# EasyEDA Pro project MSDR_EzEdaPro.eprj, schematic Schematic2
Create Date: 2024-09-18; Page Name: P1; Project Name: MSDR_EzEdaPro; Schematic Name: Schematic2; Update Date: 2024-09-18; Company: EasyEDA.com; Drawn: EasyEDA; Page Size: A4; Part Number: JLCPCB-002; Reviewed: EasyEDA; Version: V0.1
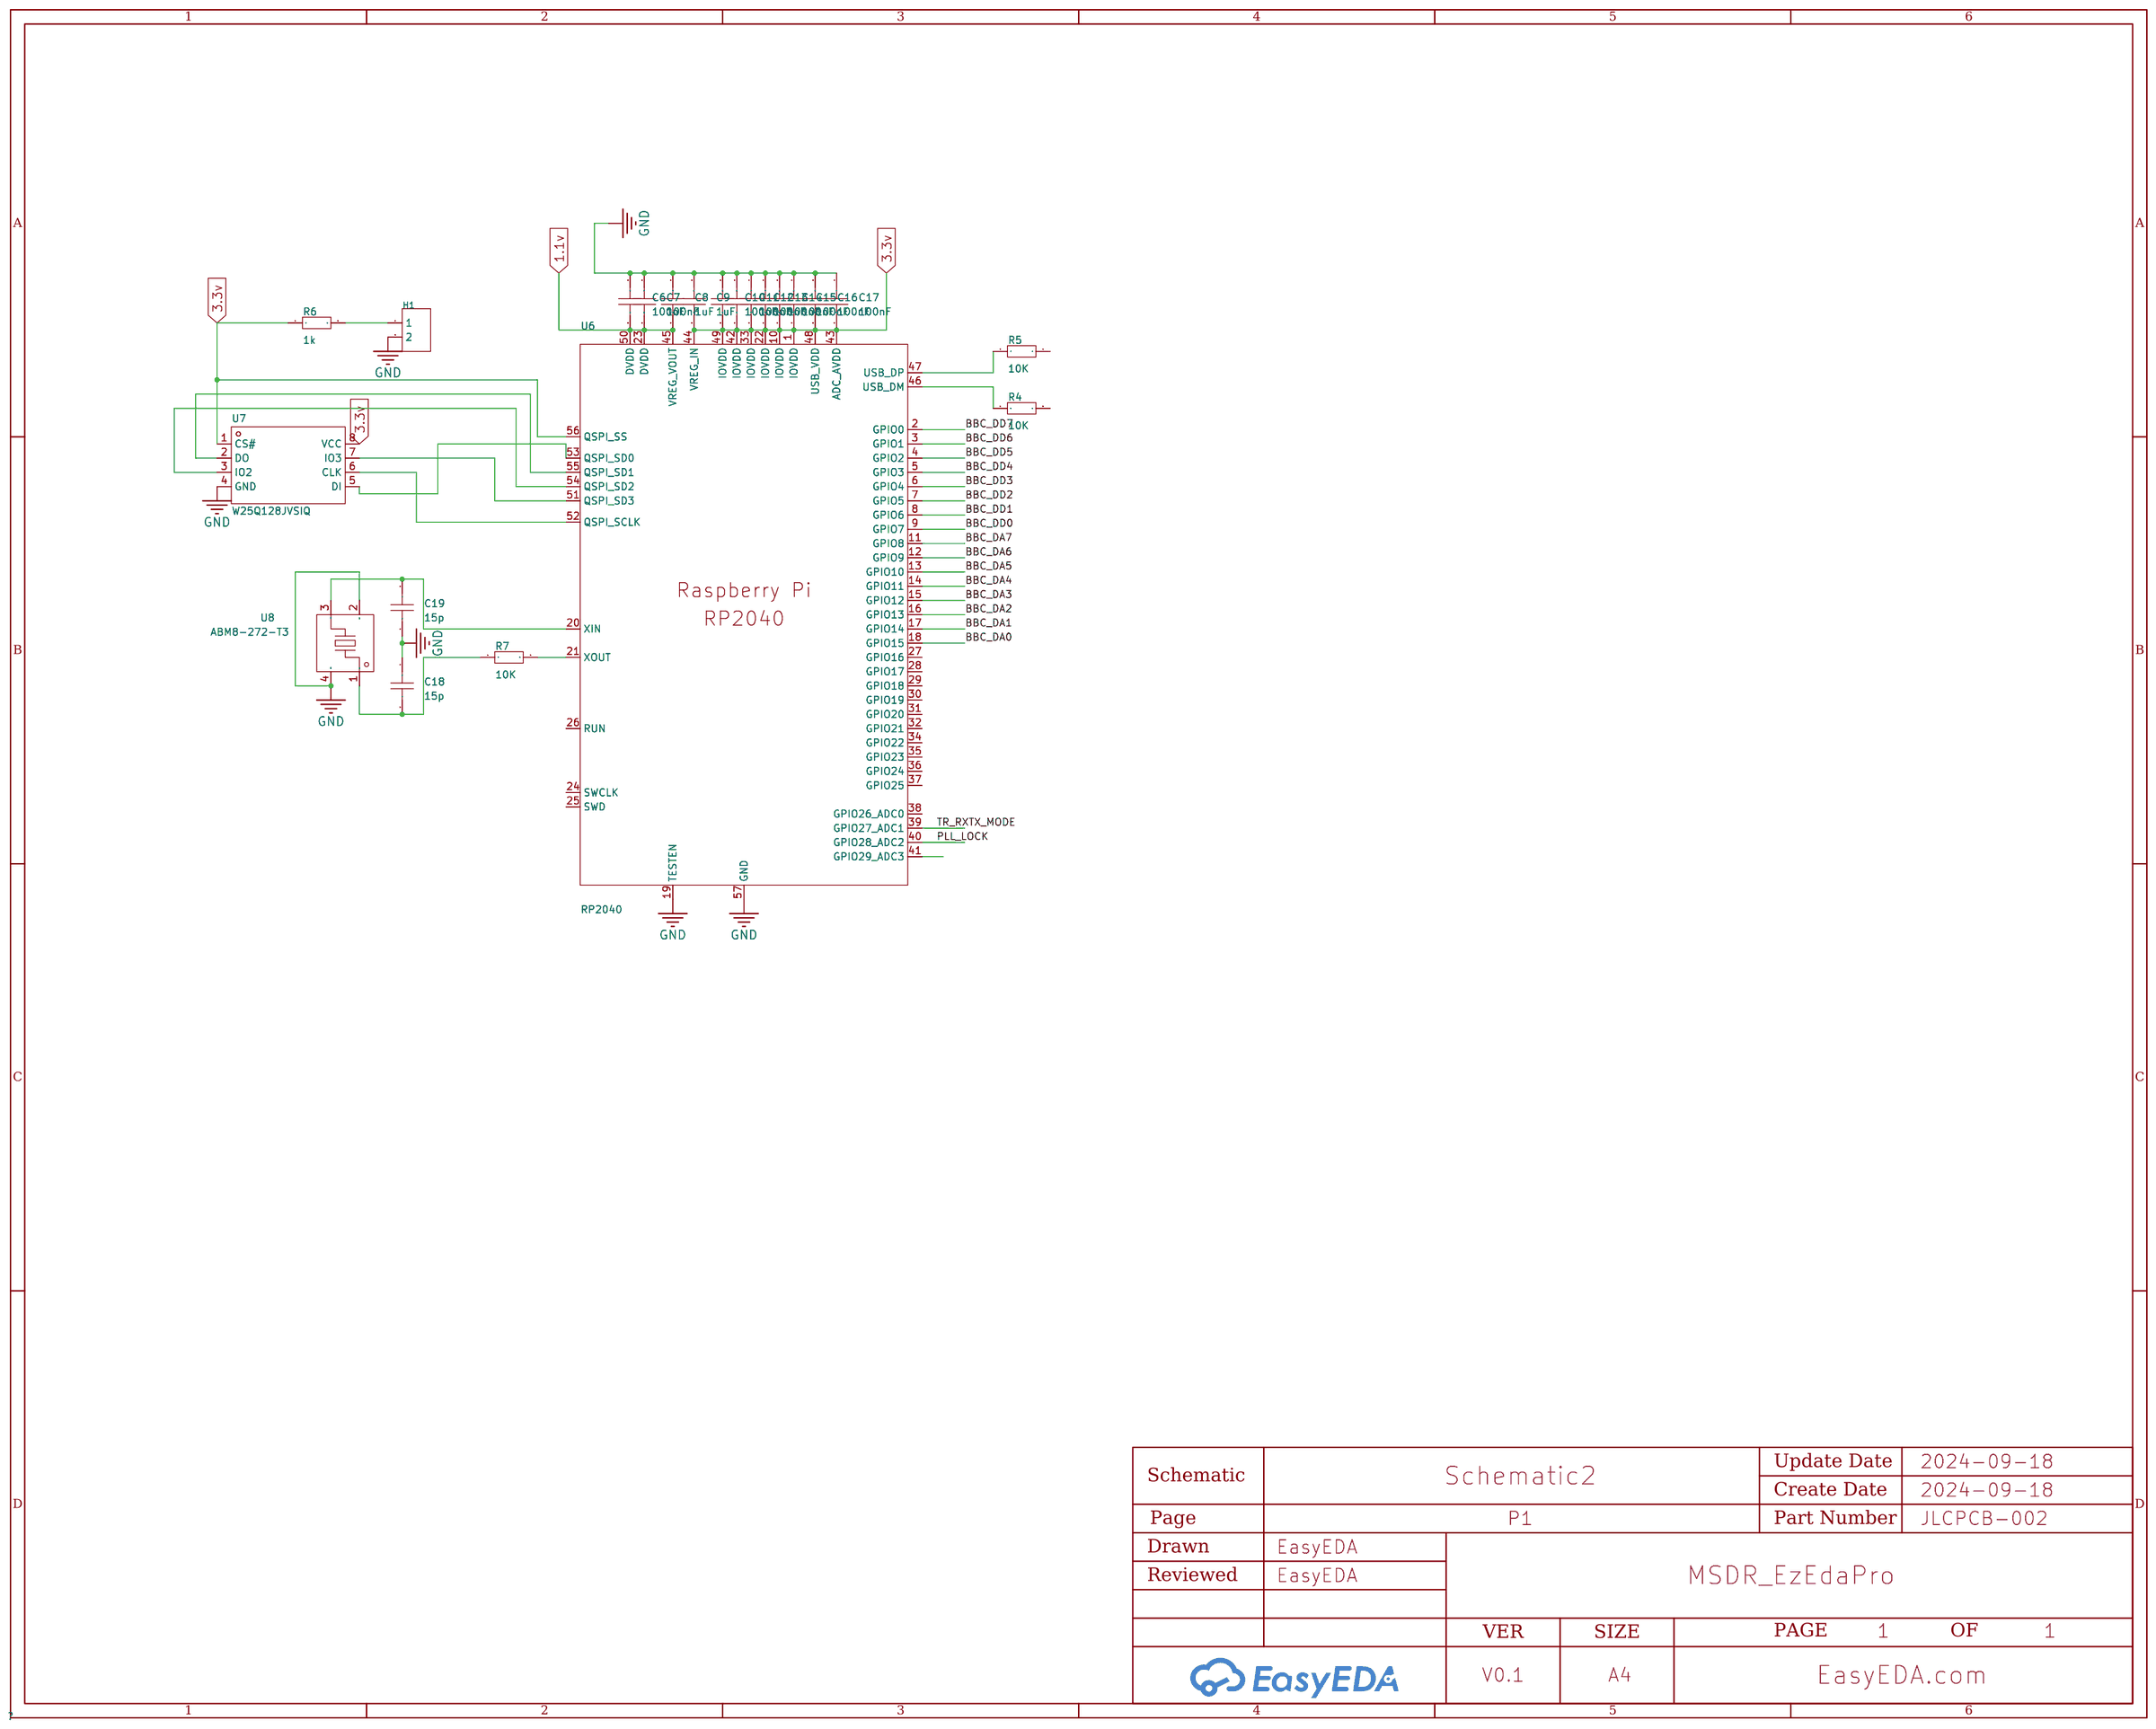
[diagram p1: schematic sheet]

## Parts
C6  100nF  [C0402]
C7  100nF  [C0402]
C8  1uF  [C0402]
C9  1uF  [C0402]
C10  100nF  [C0402]
C11  100nF  [C0402]
C12  100nF  [C0402]
C13  100nF  [C0402]
C14  100nF  [C0402]
C15  100nF  [C0402]
C16  100nF  [C0402]
C17  100nF  [C0402]
C18  15p  [C0402]
C19  15p  [C0402]
H1  -  [HDR-TH_2P-P2.54-V-F]
R4  10K  [R0402]
R5  10K  [R0402]
R6  1k  [R0402]
R7  10K  [R0402]
U6  RP2040  [LQFN-56_L7.0-W7.0-P0.4-EP]
U7  W25Q128JVSIQ  [SOIC-8_L5.3-W5.3-P1.27-LS8.0-BL]
U8  ABM8-272-T3  [CRYSTAL-SMD_4P-L3.2-W2.5-BL]

## Library data of the parts
C6-C19 = CAP_0402: Supplier Part: C1525; Supplier Footprint: 0402
H1 = HDR-F_2.54_1x2P: Supplier Footprint: Through
R4-R7 = Res_0402: Supplier Footprint: 0402
U6 = RP2040_C2040: CPU Core:- RAM Size:264KB GPIO Ports Number:30 Operating Voltage Range:- Operating Voltage Range:- CPU Maximum Speed:133MHz Program Memory Type:- Operating Temperature Range:- Operating Temperature Range:- ADC (Bit):12bit DAC (Bit):- PWM (Bit):- 8Bit Time; LCSC Part Name: RP2040（RP2B2）; Supplier Part: C2040; Manufacturer: Raspberry Pi(树莓派); Supplier Footprint: LQFN-56(7x7); JLCPCB Part Class: Extended Part; Datasheet: https://atta.szlcsc.com/upload/public/pdf/source/20210621/C2040_96F425825606B7957D87DD32E2512CA9.pdf; Supplier: LCSC; RAM Size: 264KB; GPIO Ports Number: 30; CPU Maximum Speed: 133MHz; ADC (Bit): 12bit; UART/USART: 2; I2C: 2; SPI: 2; Universal Serial Bus: 有; Peripheral/Function: DMA；PWM; Direct Memory Access: 有
U7 = W25Q128JVSIQ: Interface Type:- Memory Size:128Mbit Clock Frequency (fc):- Supply Voltage:- Supply Voltage:- Supply Current (Read):- Supply Current (Program):- Supply Current (Erase):- Standby supply current:- Page Programming Time (Tpp):- Block Erase Time (tBE):- Data; LCSC Part Name: W25Q128JVSIQ 编带; Supplier Part: C97521; Manufacturer: WINBOND(华邦); Supplier Footprint: SOIC-8-208mil; JLCPCB Part Class: Basic Part; Datasheet: https://atta.szlcsc.com/upload/public/pdf/source/20170316/1489627409956.pdf; Supplier: LCSC; Memory Size: 128Mbit
U8 = ABM8-272-T3_C20625731: Supplier Part: C20625731; Manufacturer: ABRACON; Supplier Footprint: SMD3225-4P; JLCPCB Part Class: Extended Part; Datasheet: https://atta.szlcsc.com/upload/public/pdf/source/20240227/A8BE43F636D80F75C9AF5C59EDF21E9A.pdf; Supplier: LCSC

## Nets
1.1v: C6.2 C7.2 C8.2 U6.23(DVDD) U6.45(VREG_VOUT) U6.50(DVDD)
3.3v: C9.2 C10.2 C11.2 C12.2 C13.2 C14.2 C15.2 C16.2 C17.2 R6.1 U6.1(IOVDD) U6.10(IOVDD) U6.22(IOVDD) U6.33(IOVDD) U6.42(IOVDD) U6.43(ADC_AVDD) U6.44(VREG_IN) U6.48(USB_VDD) U6.49(IOVDD) U6.56(QSPI_SS) U7.1(CS#) U7.8(VCC)
GND: C6.1 C7.1 C8.1 C9.1 C10.1 C11.1 C12.1 C13.1 C14.1 C15.1 C16.1 C17.1 C18.1 C19.2 H1.2 U6.19(TESTEN) U6.57(GND) U7.4(GND) U8.2(GND) U8.4(GND)
BBC_DA0: U6.18(GPIO15)
BBC_DA1: U6.17(GPIO14)
BBC_DA2: U6.16(GPIO13)
BBC_DA3: U6.15(GPIO12)
BBC_DA4: U6.14(GPIO11)
BBC_DA5: U6.13(GPIO10)
BBC_DA6: U6.12(GPIO9)
BBC_DA7: U6.11(GPIO8)
BBC_DD0: U6.9(GPIO7)
BBC_DD1: U6.8(GPIO6)
BBC_DD2: U6.7(GPIO5)
BBC_DD3: U6.6(GPIO4)
BBC_DD4: U6.5(GPIO3)
BBC_DD5: U6.4(GPIO2)
BBC_DD6: U6.3(GPIO1)
BBC_DD7: U6.2(GPIO0)
PLL_LOCK: U6.40(GPIO28_ADC2)
TR_RXTX_MODE: U6.39(GPIO27_ADC1)
$1N930: R5.2 U6.47(USB_DP)
$1N931: R4.2 U6.46(USB_DM)
$1N939: U6.51(QSPI_SD3) U7.7(IO3)
$1N940: U6.54(QSPI_SD2) U7.3(IO2)
$1N941: U6.53(QSPI_SD0) U7.5(DI)
$1N942: U6.55(QSPI_SD1) U7.2(DO)
$1N943: U6.52(QSPI_SCLK) U7.6(CLK)
$1N945: H1.1 R6.2
$1N948: C19.1 U6.20(XIN) U8.3
$1N950: C18.2 R7.1 U8.1
$1N951: R7.2 U6.21(XOUT)

Not connected (* = marked no-connect by the designer): R4 1; R5 1; U6 24(SWCLK) 25(SWD) 26(RUN) 27(GPIO16) 28(GPIO17) 29(GPIO18) 30(GPIO19) 31(GPIO20) 32(GPIO21) 34(GPIO22) 35(GPIO23) 36(GPIO24) 37(GPIO25) 38(GPIO26_ADC0) 41(GPIO29_ADC3)
